# EAGLE design IoT Shield.v1.2 (EAGLE 9.6.2)
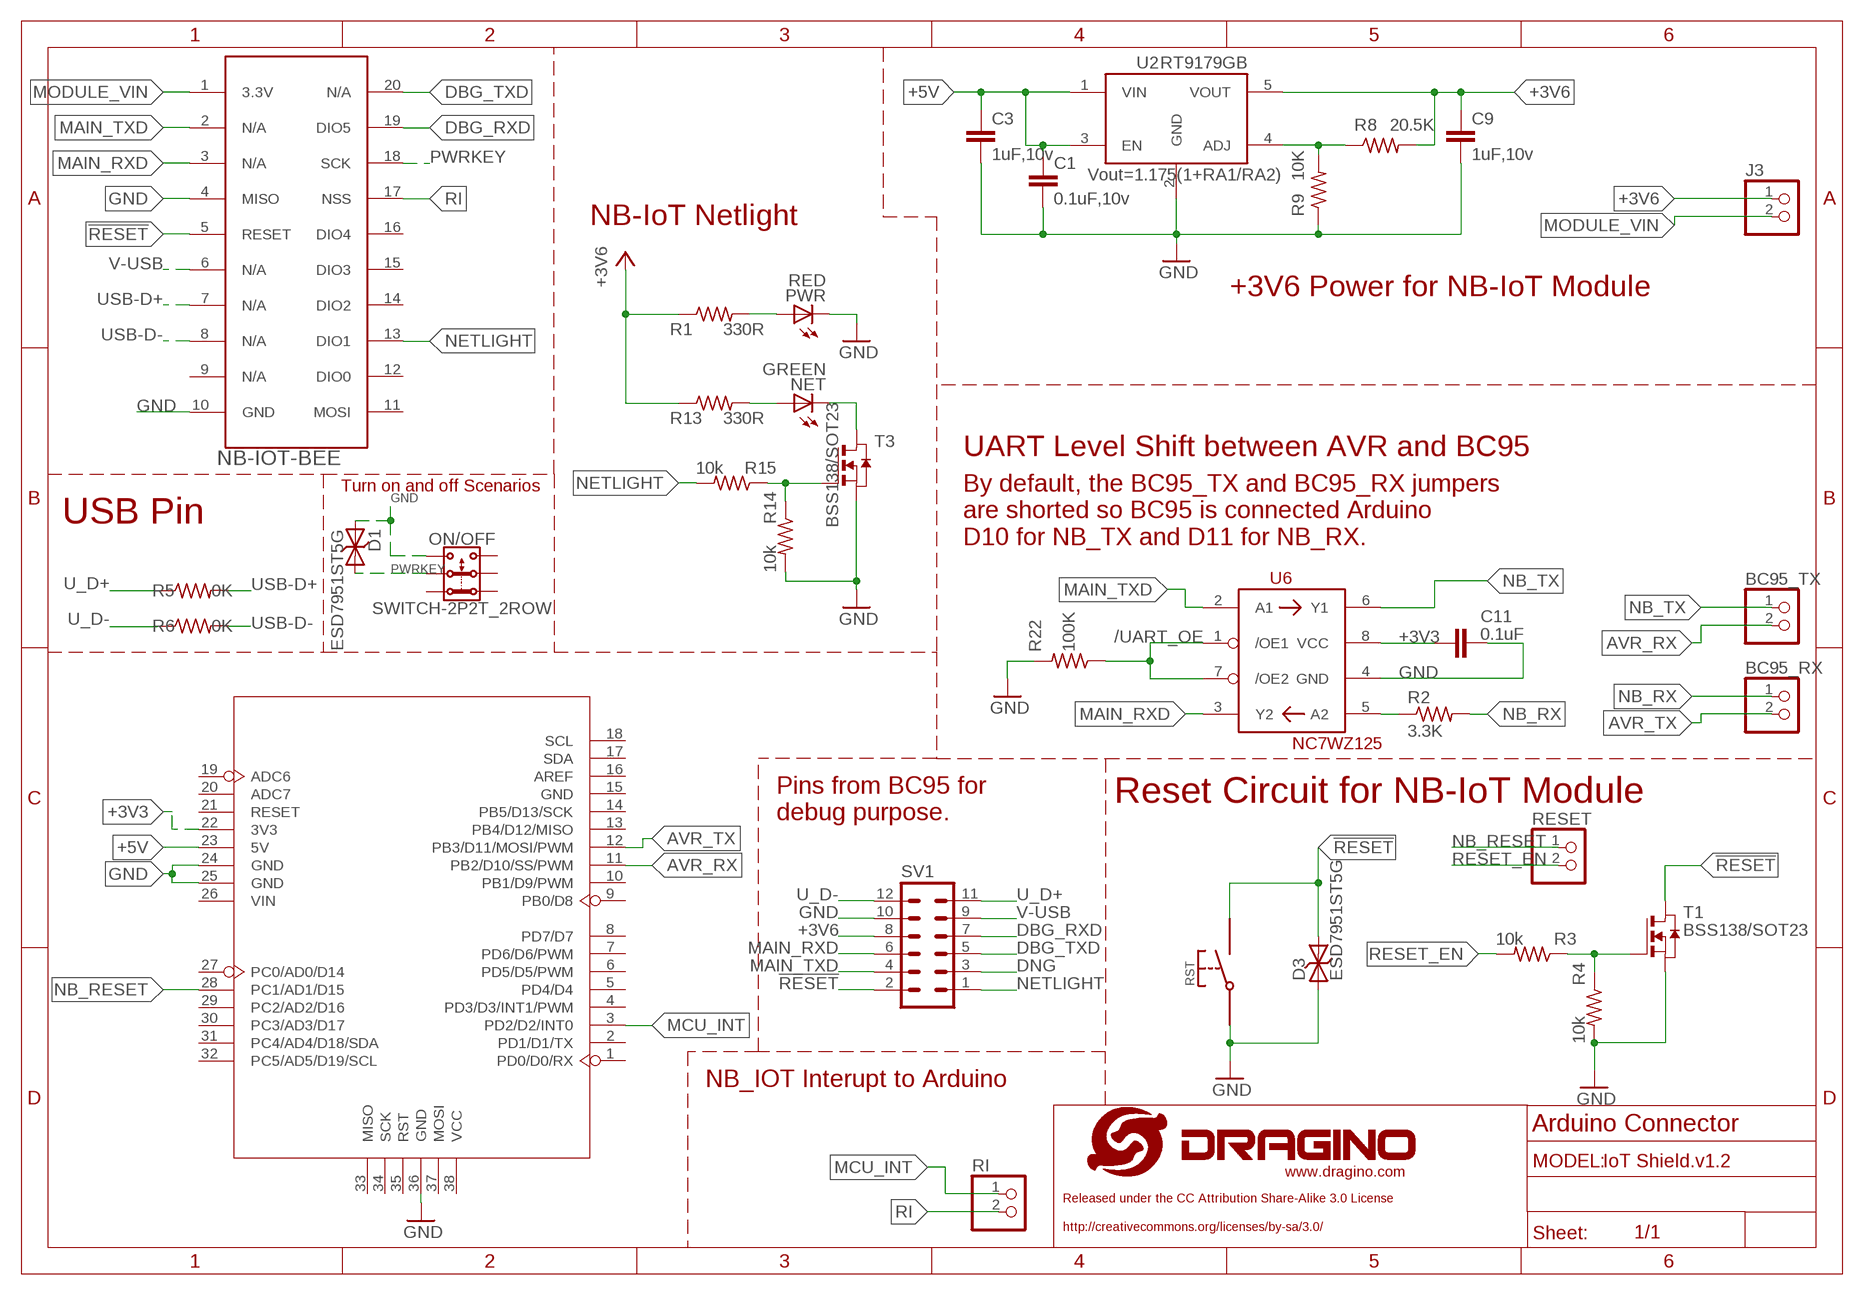
[diagram p0: schematic, sheet 1]

## Parts
BC95_RX  PINHD-1X2  [1X02]
BC95_TX  PINHD-1X2  [1X02]
C1  0.1uF,10v  C-EUC0402  [C0402]
C3  1uF,10v  C-EUC0402  [C0402]
C9  1uF,10v  C-EUC0402  [C0402]
C11  0.1uF  C-EUC0402  [C0402]
D1  ESD7951ST5G  TVSSOD−923  [SOD−923]
D3  ESD7951ST5G  TVSSOD−923  [SOD−923]
IOT-BEE  NB-IOT-BEE  LORAHAT_S  [LORA]
J3  PINHD-1X2  [1X02]
NET  GREEN  LEDCHIP-LED0603  [CHIP-LED0603]
ON/OFF  SWITCH-2P2T_2ROW  [KFT7.0-7X7]
PWR  RED  LEDCHIP-LED0603  [CHIP-LED0603]
R1  330R  R-US_R0402  [R0402]
R2  3.3K  R-US_R0402  [R0402]
R3  10k  R-US_R0402  [R0402]
R4  10k  R-US_R0402  [R0402]
R5  0K  R-US_R0402  [R0402]
R6  0K  R-US_R0402  [R0402]
R8  20.5K  R-US_R0402  [R0402]
R9  10K  R-US_R0402  [R0402]
R13  330R  R-US_R0402  [R0402]
R14  10k  R-US_R0402  [R0402]
R15  10k  R-US_R0402  [R0402]
R22  100K  R-US_R0402  [R0402]
RESET  PINHD-1X2  [1X02]
RI  PINHD-1X2  [1X02]
RST  SWITCHTS-16  [TS-016]
SV1  MA06-2  [MA06-2]
T1  BSS138/SOT23  NMOSFET-SOT23  [SOT-23]
T3  BSS138/SOT23  NMOSFET-SOT23  [SOT-23]
U2  RT9179GB  RT9179  [SOT23-5]
U5  MOUDLE_ARDUINO-38PMOUDLE_ARDUINO-38P_L  [MOUDLE_ARDUINO-38P_L]
U6  NC7WZ125  [US8]
U$1  LOGO-NEW  [LOGO-SILK-NEW]

## Nets
!RESET: D3.P$2 IOT-BEE.5(RESET) RST.P$2 SV1.2 T1.1(D)
+3V3: C11.2 U5.22(3V3) U6.8(VCC)
+3V6: C9.1 J3.1 R1.1 R8.2 R13.1 SV1.8 U2.5(VOUT)
+5V [usbvcc]: C1.1 C3.1 U2.1(VIN) U2.3(EN) U5.23(5V)
/UART_OE: R22.1 U6.1(/OE1) U6.7(/OE2)
AVR_RX: BC95_TX.2 U5.11(PB2/D10/SS/PWM)
AVR_TX: BC95_RX.2 U5.12(PB3/D11/MOSI/PWM)
DBG_RXD: IOT-BEE.19(DIO5) SV1.7
DBG_TXD: IOT-BEE.20(N/A) SV1.5
DNG: SV1.3
GND [gnd]: C1.2 C3.2 C9.2 C11.1 D1.P$1 D3.P$1 IOT-BEE.4(MISO) IOT-BEE.10(GND) ON/OFF.3.1 PWR.C R4.2 R9.1 R14.2 R22.2 RST.P$1 SV1.10 T1.2(S) T3.2(S) U2.2(GND) U5.24(GND) U5.25(GND) U5.36(GND) U6.4(GND)
MAIN_RXD: IOT-BEE.3(N/A) SV1.6 U6.3(Y2)
MAIN_TXD: IOT-BEE.2(N/A) SV1.4 U6.2(A1)
MCU_INT: RI.1 U5.3(PD2/D2/INT0)
MODULE_VIN: IOT-BEE.1(3.3V) J3.2
N$1: R3.1 R4.1 T1.3(G)
N$3: PWR.A R1.2
N$6: NET.A R13.2
N$8: NET.C T3.1(D)
N$9: R14.1 R15.1 T3.3(G)
N$10: R8.1 R9.2 U2.4(ADJ)
N$16: R2.1 U6.5(A2)
NB_RESET: RESET.1 U5.28(PC1/AD1/D15)
NB_RX: BC95_RX.1 R2.2
NB_TX: BC95_TX.1 U6.6(Y1)
NETLIGHT: IOT-BEE.13(DIO1) R15.2 SV1.1
PWRKEY: D1.P$2 IOT-BEE.18(SCK) ON/OFF.2.1
RESET_EN: R3.2 RESET.2
RI: IOT-BEE.17(NSS) RI.2
U_D+: R5.1 SV1.11
U_D-: R6.1 SV1.12
USB-D+: IOT-BEE.7(N/A) R5.2
USB-D-: IOT-BEE.8(N/A) R6.2
V-USB: IOT-BEE.6(N/A) SV1.9
Unconnected: IOT-BEE.9(N/A) IOT-BEE.11(MOSI) IOT-BEE.12(DIO0) IOT-BEE.14(DIO2) IOT-BEE.15(DIO3) IOT-BEE.16(DIO4) ON/OFF.1.1 ON/OFF.1.2 ON/OFF.2.2 ON/OFF.3.2 U5.1(PD0/D0/RX) U5.2(PD1/D1/TX) U5.4(PD3/D3/INT1/PWM) U5.5(PD4/D4) U5.6(PD5/D5/PWM) U5.7(PD6/D6/PWM) U5.8(PD7/D7) U5.9(PB0/D8) U5.10(PB1/D9/PWM) U5.13(PB4/D12/MISO) U5.14(PB5/D13/SCK) U5.15(GND) U5.16(AREF) U5.17(SDA) U5.18(SCL) U5.19(ADC6) U5.20(ADC7) U5.21(RESET) U5.26(VIN) U5.27(PC0/AD0/D14) U5.29(PC2/AD2/D16) U5.30(PC3/AD3/D17) U5.31(PC4/AD4/D18/SDA) U5.32(PC5/AD5/D19/SCL) U5.33(MISO) U5.34(SCK) U5.35(RST) U5.37(MOSI) U5.38(VCC)

## Notes on the sheet
- NB-IoT Netlight
- +3V6 Power for NB-IoT Module
- UART Level Shift between AVR and BC95
- Turn on and off Scenarios
- USB Pin
- By default, the BC95_TX and BC95_RX jumpers 
  are shorted so BC95 is connected Arduino
  D10 for NB_TX and D11 for NB_RX.
- Reset Circuit for NB-IoT Module
- Pins from BC95 for
  debug purpose.
- NB_IOT Interupt to Arduino
- Arduino Connector

## Library data of the parts
BC95_RX BC95_TX J3 RESET RI = pinhead:PINHD-1X2: PIN HEADER
C1 C3 C9 C11 = dragino:C-EU: CAPACITOR, European symbol
D1 D3 = dragino:TVS: DIODE
IOT-BEE = dragino:LORAHAT
NET PWR = dragino:LED: LED OSRAM: - CHIPLED LG R971, LG N971, LY N971, LG Q971, LY Q971, LO R971, LY R971 LH N974, LH R974 LS Q976, LO Q976, LY Q976 LO Q996 - Hyper CHIPLED LW Q18S LB Q993, LB Q99A, LB R99A - SideLED LS A670, LO A670, LY A670, LG A670, LP A670 LB A673, LV A673, LT A673, LW A673 LH A674 LY A675 LS A676, LA A676, LO A676, LY A676, LW A676 LS A679, LY A679, LG A679 - Hyper Micro SIDELED® LS Y876, LA Y876, LO Y876, LY Y876 LT Y87S - SmartLED LW L88C, LW L88S LB L89C, LB L89S, LG L890 LS L89K, LO L89K, LY L89K LS L896, LA L896, LO L896, LY L896 - TOPLED LS T670, LO T670, LY T670, LG T670, LP T670 LSG T670, LSP T670, LSY T670, LOP T670, LYG T670 LG T671, LOG T671, LSG T671 LB T673, LV T673, LT T673, LW T673 LH T674 LS T676, LA T676, LO T676, LY T676, LB T676, LH T676, LSB T676, LW T676 LB T67C, LV T67C, LT T67C, LS T67K, LO T67K, LY T67K, LW E67C LS E67B, LA E67B, LO E67B, LY E67B, LB E67C, LV E67C, LT E67C LW T67C LS T679, LY T679, LG T679 LS T770, LO T770, LY T770, LG T770, LP T770 LB T773, LV T773, LT T773, LW T773 LH T774 LS E675, LA E675, LY E675, LS T675 LS T776, LA T776, LO T776, LY T776, LB T776 LHGB T686 LT T68C, LB T68C - Hyper Mini TOPLED® LB M676 - Mini TOPLED Santana® LG M470 LS M47K, LO M47K, LY M47K Source: http://www.osram.convergy.de LUXEON: - LUMILED® LXK2-PW12-R00, LXK2-PW12-S00, LXK2-PW14-U00, LXK2-PW14-V00 LXK2-PM12-R00, LXK2-PM12-S00, LXK2-PM14-U00 LXK2-PE12-Q00, LXK2-PE12-R00, LXK2-PE12-S00, LXK2-PE14-T00, LXK2-PE14-U00 LXK2-PB12-K00, LXK2-PB12-L00, LXK2-PB12-M00, LXK2-PB14-N00, LXK2-PB14-P00, LXK2-PB14-Q00 LXK2-PR12-L00, LXK2-PR12-M00, LXK2-PR14-Q00, LXK2-PR14-R00 LXK2-PD12-Q00, LXK2-PD12-R00, LXK2-PD12-S00 LXK2-PH12-R00, LXK2-PH12-S00 LXK2-PL12-P00, LXK2-PL12-Q00, LXK2-PL12-R00 Source: www.luxeon.com KINGBRIGHT: KA-3528ASYC Source: www.kingbright.com
ON/OFF = dragino-passive:SWITCH-2P2T_2ROW
R1-R6 R8 R9 R13-R15 R22 = dragino:R-US_: RESISTOR, American symbol
RST = dragino:SWITCH
SV1 = con-lstb:MA06-2: PIN HEADER; OC_FARNELL: unknown; OC_NEWARK: unknown
T1 T3 = dragino:NMOSFET-SOT23: MOS FET; OC_FARNELL: unknown; OC_NEWARK: unknown
U2 = dragino:RT9179
U5 = board_arduino:MOUDLE_ARDUINO-38P
U6 = dragino:NC7WZ125: 3 state buffer: http://www.fairchildsemi.com/ds/NC/NC7WZ125.pdf
U$1 = dragino:LOGO-NEW

## Net classes
0 default: width 0.203 mm, clearance 0.203 mm
1 power: width 0.254 mm, drill 0.61 mm, clearance 0.254 mm
2 gnd: width 0.305 mm, drill 0.254 mm, clearance 0.203 mm
3 usbvcc: width 0.254 mm, drill 0.61 mm, clearance 0.254 mm
4 aref: width 0.254 mm, drill 0.61 mm, clearance 0.254 mm
5 usbtrace: width 0.254 mm, clearance 0.152 mm

## Board
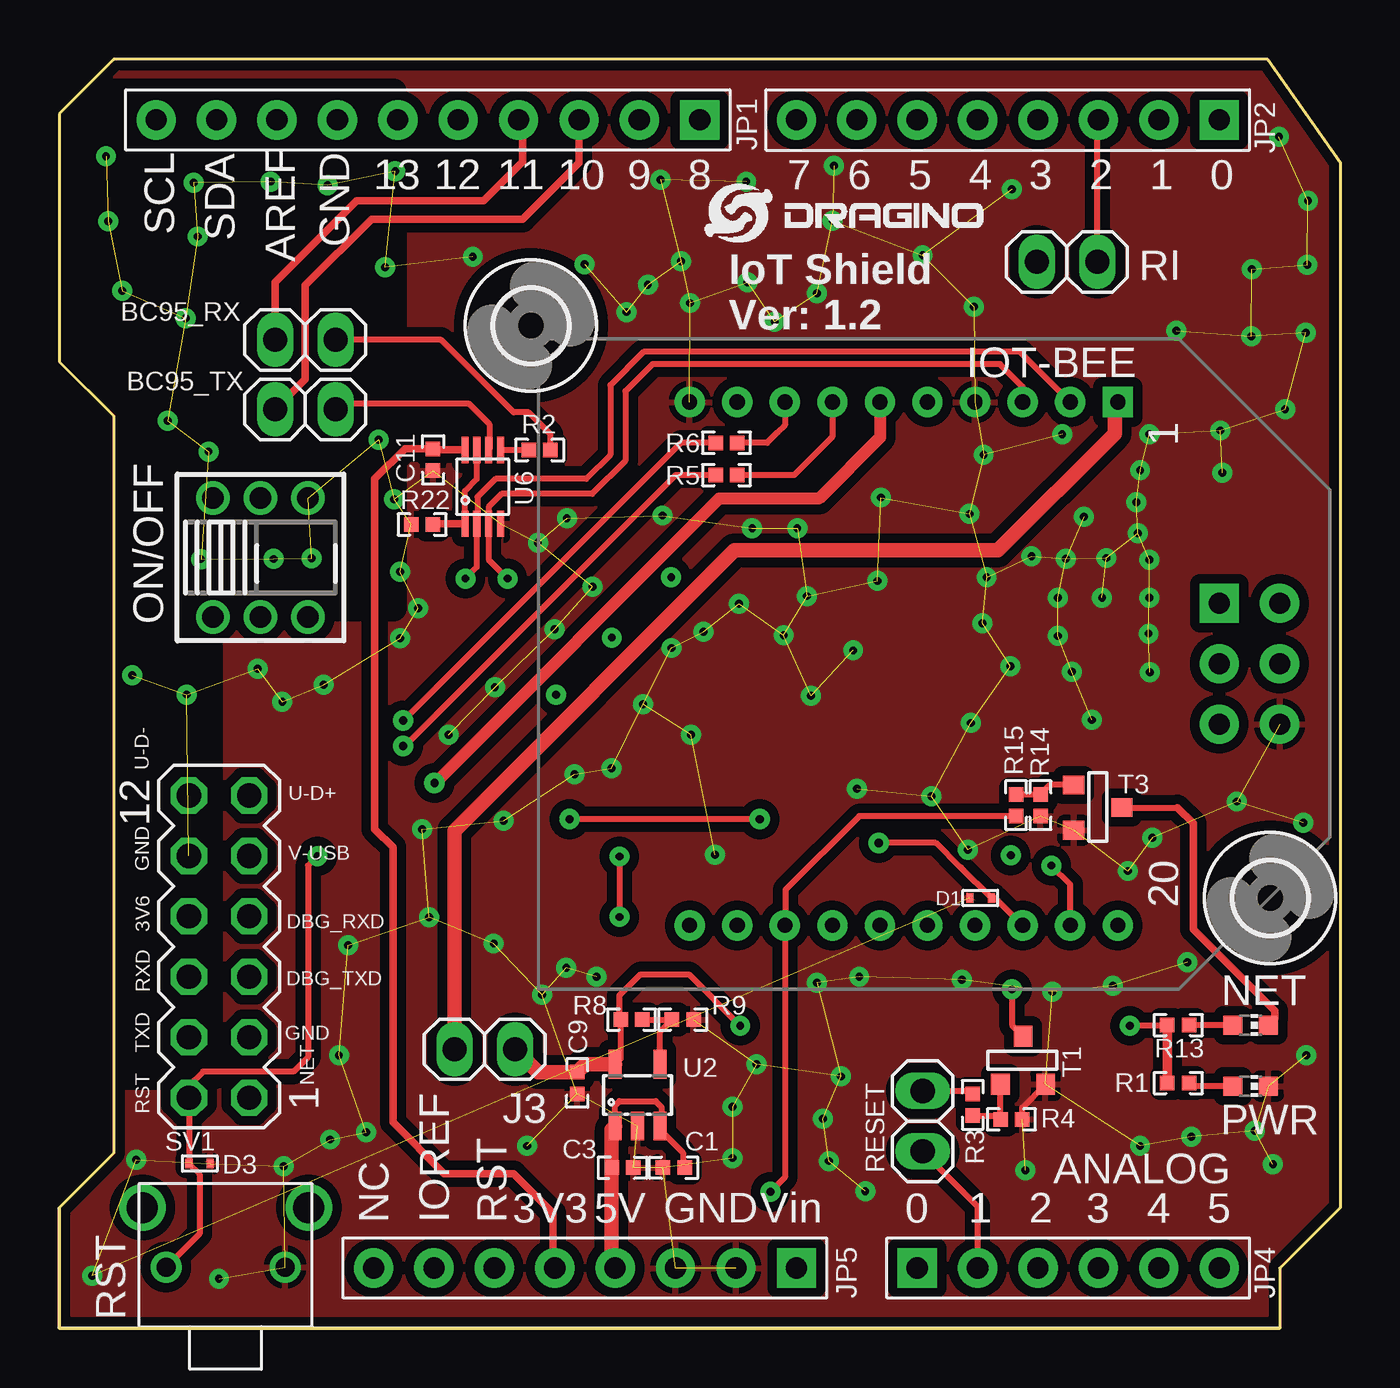
[diagram p1: board, top side]
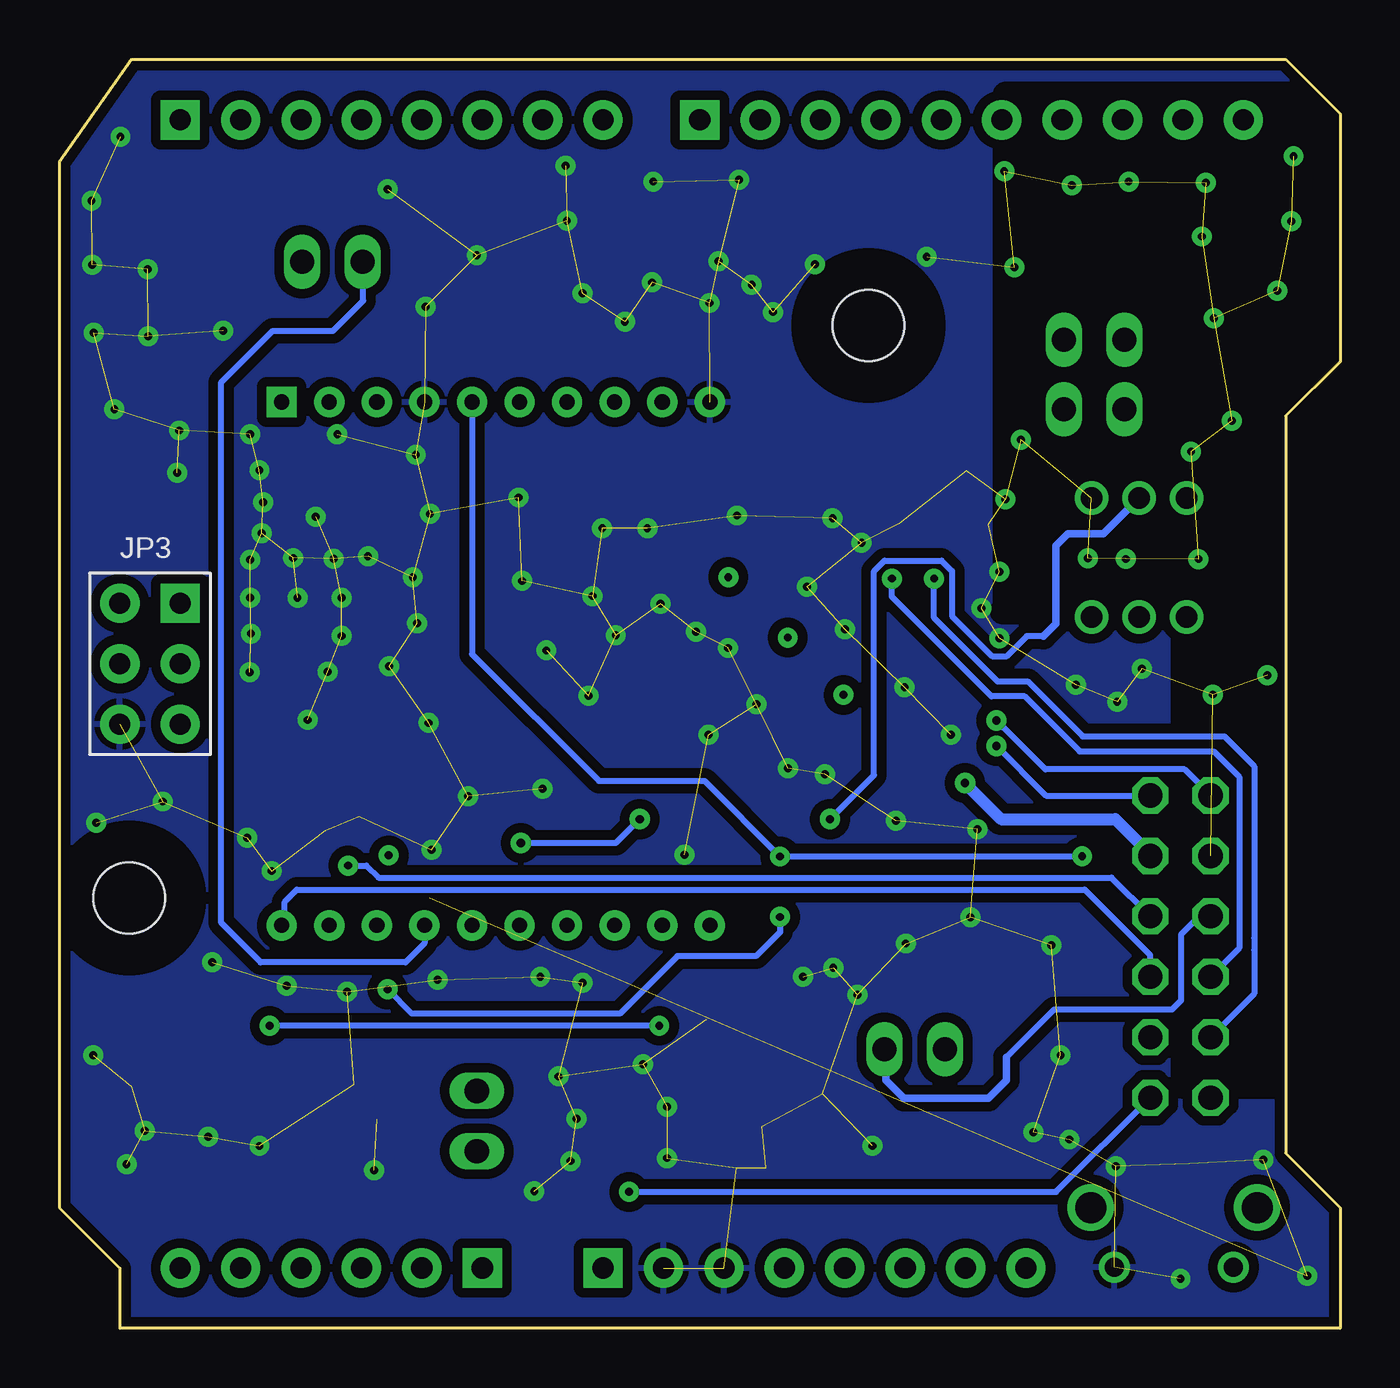
[diagram p2: board, bottom side, seen from below]

Size 53.85 x 53.34 mm. Coordinates in mm from the lower left corner, seen from the top.
Copper layers (1*16): Top 0.035mm / dielectric 1.5mm / Bottom 0.035mm
Design rules "default *": minimum track width 8mil, minimum drill 13mil, track to track 6mil, track to pad 6mil, pad to pad 6mil, via to via 6mil, smd to smd 6mil, copper to edge 10mil, drill to drill 8mil, minimum pad ring 10mil, minimum via ring 10mil, stop-mask expansion 2mil, vias tented up to drill 20mil, thermal gap 10mil
tRestrict: area 0.1,10.6 to 14.1,52
bRestrict: area 0.1,10.2 to 14.2,52
vRestrict: area 42,38 to 42.5,38.3; area 35.3,34.6 to 35.9,35.1; area 43.9,34.6 to 44.7,35.1; area 40.7,34.6 to 41.2,35.1; area 47.3,9.7 to 48,10.2; area 49.9,9.6 to 50.4,10.5

### Footprints (pad centres in the part's own frame; a part is rotated, then mirrored left to right if it is on the bottom)
1X02 = drill 1.016 long: 1 -1.27,0; 2 1.27,0
C0402 = smd 0.61 x 0.61: 1 -0.457,0; 2 0.457,0
SOD−923 = smd 0.3 x 0.4: P$1 -0.45,0; P$2 0.45,0
LORA = drill 0.635 pad 1.27 square: 1 -11,7.62 | drill 0.635 pad 1.27: 2 -11,5.62; 3 -11,3.62; 4 -11,1.62; 5 -11,-0.38; 6 -11,-2.38; 7 -11,-4.38; 8 -11,-6.38; 9 -11,-8.38; 10 -11,-10.38; 11 11,-10.38; 12 11,-8.38; 13 11,-6.38; 14 11,-4.38; 15 11,-2.38; 16 11,-0.38; 17 11,1.62; 18 11,3.62; 19 11,5.62; 20 11,7.62
CHIP-LED0603 = smd 0.8 x 0.8: A 0,-0.75; C 0,0.75
KFT7.0-7X7 = drill 0.9: 1.1 -2,2.5; 1.2 -2,-2.5; 2.1 0,2.5; 2.2 0,-2.5; 3.1 2,2.5; 3.2 2,-2.5
R0402 = smd 0.61 x 0.61: 1 -0.457,0; 2 0.457,0
TS-016 = drill 0.8: P$1 -2.5,2.5; P$2 2.5,2.5 | drill 1.3: P$3 -3.5,0; P$4 3.5,0
MA06-2 = drill 1.016 octagon: 1 -6.35,-1.27; 2 -6.35,1.27; 3 -3.81,-1.27; 4 -3.81,1.27; 5 -1.27,-1.27; 6 -1.27,1.27; 7 1.27,-1.27; 8 1.27,1.27; 9 3.81,-1.27; 10 3.81,1.27; 11 6.35,-1.27; 12 6.35,1.27
SOT-23 = smd 0.787 x 0.889: 1 0,-1.016; 2 -0.95,1.016; 3 0.95,1.016
SOT23-5 = smd 0.55 x 1.2: 1 -0.95,-1.3; 2 0,-1.3; 3 0.95,-1.3; 4 0.95,1.3; 5 -0.95,1.3
MOUDLE_ARDUINO-38P_L = drill 0.889 pad 1.651 square: 1 21.59,22.86; 9 -0.254,22.86; 26 3.81,-25.4; 27 8.89,-25.4; 33 21.59,2.54 | drill 0.889 pad 1.651: 2 19.05,22.86; 3 16.51,22.86; 4 13.97,22.86; 5 11.43,22.86; 6 8.89,22.86; 7 6.35,22.86; 8 3.81,22.86; 10 -2.794,22.86; 11 -5.334,22.86; 12 -7.874,22.86; 13 -10.414,22.86; 14 -12.954,22.86; 15 -15.494,22.86; 16 -18.034,22.86; 17 -20.574,22.86; 18 -23.114,22.86; 19 -13.97,-25.4; 20 -11.43,-25.4; 21 -8.89,-25.4; 22 -6.35,-25.4; 23 -3.81,-25.4; 24 -1.27,-25.4; 25 1.27,-25.4; 28 11.43,-25.4; 29 13.97,-25.4; 30 16.51,-25.4; 31 19.05,-25.4; 32 21.59,-25.4; 34 21.59,0; 35 21.59,-2.54; 36 24.13,-2.54; 37 24.13,0; 38 24.13,2.54
US8 = smd 0.3 x 1.1: 1 -0.75,-1.55; 2 -0.25,-1.55; 3 0.25,-1.55; 4 0.75,-1.55; 5 0.75,1.55; 6 0.25,1.55; 7 -0.25,1.55; 8 -0.75,1.55
3,0 = hole 3: 0,0

### Placement (x,y rotation side)
BC95_RX  10.34,41.55 180 top
BC95_TX  10.34,38.63 180 top
C1  25.83,6.76 180 top
C3  23.67,6.76 0 top
C9  21.77,10.31 270 top
C11  15.71,36.51 90 top
D1  38.73,18.1 0 top
D3  5.89,6.93 180 top
IOT-BEE  36.88,27.94 270 top
J3  17.88,11.73 180 top
NET  50.09,12.75 270 top
ON/OFF  8.45,32.41 0 top
PWR  50.09,10.19 270 top
R1  47.04,10.31 0 top
R2  20.19,36.93 0 top
R3  38.4,9.4 90 top
R4  40.03,8.79 0 top
R5  28.05,35.87 0 top
R6  28.05,37.23 0 top
R8  24.05,12.98 180 top
R9  26.21,12.98 180 top
R13  47.04,12.75 0 top
R14  41.25,22 270 top
R15  40.22,22 270 top
R22  15.25,33.8 180 top
RESET  36.3,8.71 90 top
RI  42.37,44.83 180 top
RST  6.99,5.08 180 top
SV1  6.71,16.05 90 top
T1  40.52,11.27 180 top
T3  43.66,21.89 90 top
U2  24.31,9.8 0 top
U5  27.18,27.94 0 top
U6  17.8,35.38 0 top
U$1  27.13,45.65 0 top
U$2  [3,0]  50.91,18.09 0 top
U$3  [3,0]  19.83,42.16 0 top

### Tracks (layer width: path | path; a pad name or v marks a point on that pad's centre or on a via)
!RESET  (via drill 0.33)
  Top 0.254: v23.55,19.84 v23.55,17.3 | v40.06,14.25 40.06,12.75 T1.1 | RST.P$2 5.89,3.99 5.89,6.48 D3.P$2 5.45,6.94 SV1.2 5.44,10.2 6.04,10.8 9.84,10.8 10.45,11.41 10.45,19.45 v10.84,19.85
  Bottom 0.254: v10.84,19.85 v23.54,19.85 v23.55,19.84 26.72,23.01 31.17,23.01 36.5,28.35 IOT-BEE.5 | v23.55,17.3 23.55,16.66 24.56,15.65 27.86,15.65 30.28,13.23 39.04,13.23 v40.06,14.25
+3V3
  Top 0.305: U6.8 15.75,36.93 C11.2 15.7,36.98 14.53,36.98 13.26,35.71 13.26,20.98 14.02,20.22 14.02,8.66 16.18,6.5 19.1,6.5 20.75,4.85 20.75,2.62 U5.22
+3V6  (via drill 0.33)
  Top 0.254: U2.5 23.6,11.34 R8.2 23.55,13.03 23.55,14 24.43,14.88 26.47,14.88 v28.63,12.73 | v45.01,12.73 45.03,12.75 R13.1
  Top 0.406: R13.1 R1.1
  Top 0.61: U2.5 22.1,11.1 C9.1 20.12,10.77 J3.1
  Bottom 0.254: v28.63,12.73 v45.01,12.73 | 14.02,11.41 12.02,13.41 7.06,13.41 6.69,13.78 6.69,16.56 5.93,17.32 SV1.8
  Bottom 0.305: 14.02,11.41 14.02,10.44 14.78,9.68 18.34,9.68 19.1,10.44 19.1,11.68 J3.1 | 14.02,11.41
+5V
  Top 0.254: U2.1 23.36,9.36 23.55,9.55 25.07,9.55 25.32,9.3 25.32,8.57 U2.3 25.26,8.35 26.21,7.39 26.21,6.83 C1.1
  Top 0.61: U5.23 23.22,2.54 C3.1 23.22,8.36 U2.1
/UART_OE
  Top 0.254: U6.1 17.05,35.21 17.55,35.71 U6.7
  Top 0.305: R22.1 15.74,33.83 U6.1
AVR_RX
  Top 0.305: U5.11 21.84,49 19.48,46.63 13.13,46.63 10.34,43.84 10.34,39.9 BC95_TX.2
AVR_TX
  Top 0.254: 19.35,50.75 U5.12
  Top 0.305: U5.12 19.48,50.62 19.48,49.05 17.83,47.4 12.5,47.4 9.07,43.97 BC95_RX.2
DBG_RXD  (via drill 0.33)
  Top 0.254: IOT-BEE.19 42.5,18.66 v41.71,19.46
  Bottom 0.254: v41.71,19.46 40.94,19.46 40.44,18.95 9.61,18.95 SV1.7
DBG_TXD
  Bottom 0.254: IOT-BEE.20 44.37,17.07 44.37,17.93 43.87,18.44 10.73,18.44 7.98,15.69 SV1.5
GND  (via drill 0.33, 0.33 pad 0.3)  (161 unrouted)
  Top 0.254: R4.2 40.49,9.28 T1.2
  other vias: 25.37,34.17 16.36,24.96 27.08,29.29 21.66,23.29 24.54,26.23 39.98,27.84 31.03,33.63 38.99,31.57 38.27,34.24 31.43,30.79 45.82,32.31 38.86,36.73 34.39,31.42 42.16,37.59 45.44,36.07 45.82,37.59 48.82,37.74 43.08,34.11 44.02,32.39 48.9,35.97 32.56,48.87 41.99,29.11 50.11,41.71 52.4,41.86 50.14,44.53 52.48,44.7 52.5,47.4 51.28,50.09 28.88,48.21 40.06,47.88 32.51,46.56 5.64,48.16 8.89,48.21 11.28,48.06 14.12,48.64 13.69,44.6 25.27,48.29 5.82,45.9 1.96,49.28 2.06,46.53 31.85,43.51 21.34,34.06 42.57,27.61 41.99,30.71 45.82,30.71 28.57,30.45 20.12,33.02 33.53,22.68 45.29,34.72 45.34,33.43 40.88,32.45 45.85,27.58 43.84,30.71 45.8,29.21 38.81,29.64 42.32,32.36 17.38,45.05 22.07,44.73 26.14,44.86 28.93,43.97 36.3,45.11 38.46,42.95 30.07,42.32 46.96,41.94 51.54,38.63 34.55,34.93 29.13,33.63 22.41,31.17 30.45,29.13 33.38,28.5 31.6,26.59 36.66,22.37 38.33,25.45 43.41,25.58 38.2,20.12 44.93,19.23 45.95,20.62 49.5,22.15 52.3,21.26 47.42,15.39 44.3,14.4 41.76,14.15 37.95,14.66 33.63,14.78 31.85,14.53 32.87,10.59 29.31,11.1 32.11,8.81 32.36,7.04 33.88,5.77 40.61,6.65 45.44,7.67 51.03,6.91 50.27,8.31 52.43,11.48 47.6,8.05 28.3,7.16 28.3,9.32 19.66,7.67 11.39,7.94 1.37,2.21 6.71,2.08 9.42,6.82 3.22,7.09 18.26,16.18 11.75,11.48 12.89,8.25 20.29,14.02 22.58,14.78 21.31,15.16 15.25,20.98 15.55,17.29 18.67,21.34 5.34,26.65 3.05,27.46 9,32.35 14.33,31.8 14.33,29.01 11.1,27.05 15.09,30.28 9.37,26.34 8.34,27.73 10.61,32.37 4.55,38.15 2.64,43.61 5.31,42.47 5.95,32.34 13.42,37.35 6.27,36.86 23.85,42.72 24.74,43.87 26.52,43.1 25.73,28.6 23.22,23.55 18.31,26.95 20.82,29.39 12.14,16.1 26.55,24.95 14.07,34.85 27.56,19.9
  pour Bottom (isolate 0.406, rank 2): -0.48,53.98 55.5,53.98 55.5,-0.81 -0.51,-0.6
  pour Top (isolate 0.406, rank 2): -0.46,53.98 55.52,53.98 55.57,-0.89 -0.48,-0.57
GND1  (via drill 0.33)
  other vias: 25.72,31.58
GND2  (via drill 0.33)
  other vias: 23.22,29.04
GND3  (via drill 0.33)
  other vias: 20.88,26.63
GND4  (via drill 0.33)
  other vias: 40,19.88
MAIN_RXD  (via drill 0.33)
  Top 0.254: IOT-BEE.3 40.5,39.59 39.55,40.54 24.94,40.54 23.8,39.4 23.8,36.47 22.4,35.08 18.59,35.08 18.05,34.53 U6.3 18.05,32.32 v18.85,31.52
  Bottom 0.254: v18.85,31.52 18.85,30.76 14.66,26.57 13.26,26.57 10.95,24.26 5.31,24.26 4.24,23.19 4.24,15.98 SV1.6
MAIN_TXD  (via drill 0.33)
  Top 0.254: IOT-BEE.2 40.39,41.05 24.56,41.05 23.16,39.65 23.16,36.73 22.15,35.71 18.34,35.71 17.58,34.95 17.58,33.85 U6.2 17.55,32 v17.07,31.52
  Bottom 0.254: 3.61,16.41 3.61,23.63 4.86,24.89 10.81,24.89 13.13,27.2 14.4,27.2 17.07,29.87 v17.07,31.52 | 3.61,16.41 3.61,15.9 | 3.61,16.41 3.61,14.08 SV1.4
MCU_INT
  Top 0.254: RI.1 43.64,50.75 U5.3
MODULE_VIN
  Top 0.61: J3.2 16.61,20.93 28.38,32.7 39.46,32.7 44.37,37.62 44.37,38.81 IOT-BEE.1
N$1
  Top 0.254: R3.1 39.42,8.94 R4.1 T1.3
N$3
  Top 0.254: PWR.A 47.62,10.19 R1.2
N$6
  Top 0.254: NET.A R13.2
N$8
  Top 0.254: T3.1 47.02,21.89 | 51.1,13.02 NET.C
  Top 0.305: 51.1,13.02 51.1,13.36 47.68,16.79 47.68,21.23 47.02,21.89
N$9
  Top 0.254: R15.1 R14.1 41.64,22.84 T3.3
N$10
  Top 0.254: U2.4 25.26,12.48 R9.2 R8.1
N$16
  Top 0.254: U6.5 R2.1
NB_RESET
  Top 0.254: RESET.1 38.61,5.13 U5.28
NB_RX
  Top 0.254: R2.2 20.65,37.59 19.74,38.51 19.1,38.51 16.05,41.55 BC95_RX.1
NB_TX
  Top 0.254: BC95_TX.1 11.86,38.89 17.2,38.89 18.08,38 18.08,36.96 U6.6
NETLIGHT  (via drill 0.33)
  Top 0.254: R15.2 33.63,21.54 30.53,18.44 30.53,16.97 IOT-BEE.13 30.5,6.35 v29.9,5.74
  Bottom 0.254: SV1.1 11.94,5.74 v29.9,5.74
PWRKEY  (via drill 0.35)
  Top 0.254: IOT-BEE.18 39.34,18.1 D1.P$2 37.91,19.37 37.89,19.37 36.85,20.41 v34.45,20.41 | v29.45,21.41 v21.45,21.41
  Bottom 0.254: v34.45,20.41 30.45,20.41 v29.45,21.41 | 12.47,29.1 13.17,29.1 14.01,28.26 14.64,28.26 16.32,29.94 16.32,31.83 16.76,32.27 19.16,32.27 19.6,31.83 19.6,23.26 v21.45,21.41
  Bottom 0.305: ON/OFF.2.1 9.95,33.41 11.45,33.41 11.95,32.91 11.95,29.63 12.47,29.1
RESET_EN
  Top 0.254: RESET.2 38.28,9.98 R3.2
RI
  Bottom 0.254: RI.2 41.07,44.81 41.07,43.21 42.34,41.94 44.88,41.94 47.04,39.78 47.04,17.04 45.39,15.39 39.29,15.39 38.5,16.19 IOT-BEE.17
U_D+  (via drill 0.35)
  Top 0.254: R5.1 25.91,35.87 14.45,24.41 v14.45,24.49
  Bottom 0.254: v14.45,24.49 12.36,22.4 SV1.11
U_D-  (via drill 0.35)
  Top 0.254: R6.1 26.13,37.23 v14.45,25.55
  Bottom 0.254: v14.45,25.55 14.15,25.25 14.14,25.25 12.38,23.5 6.54,23.5 SV1.12
USB-D+
  Top 0.254: IOT-BEE.7 32.5,37.48 30.89,35.87 R5.2
USB-D-
  Top 0.254: IOT-BEE.8 30.5,37.97 30.2,37.66 29.76,37.23 R6.2
V-USB  (via drill 0.35)
  Top 0.508: IOT-BEE.6 34.5,37.46 31.93,34.88 27.74,34.88 15.79,22.93 v15.77,22.93
  Bottom 0.508: v15.77,22.93 14.25,21.41 9.45,21.41 7.98,19.94 SV1.9

### Text on the board
tNames: IoT Shield / Ver: 1.2 | U-D- | U-D+ | GND | V-USB | 3V6 | DBG_RXD | RXD | DBG_TXD | GND | TXD | NET | RST
ReferenceLC: X2